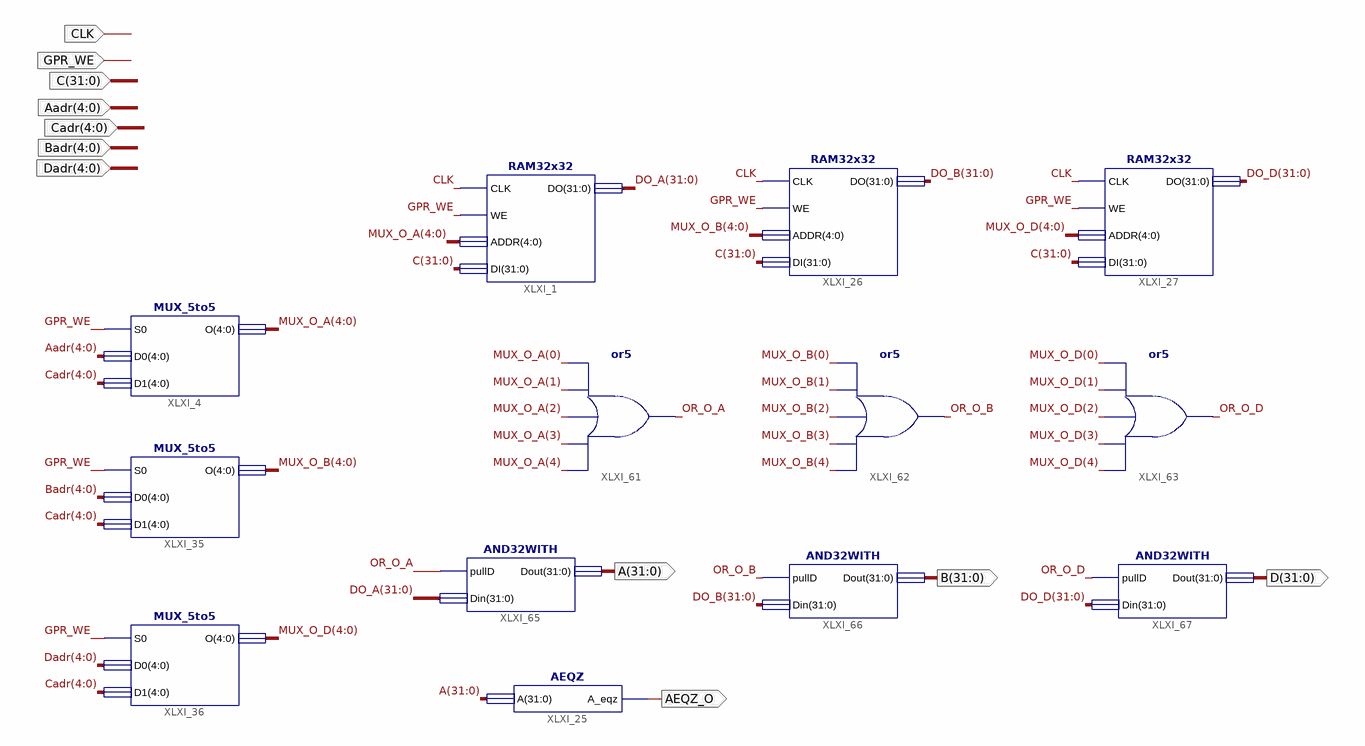
[diagram p0: schematic sheet 1]
// Xilinx ISE schematic GPR_ENVIR.sch (spartan6) as structural Verilog: 13 symbols, 11 ports
module GPR_ENVIR (
  input  CLK,
  input  GPR_WE,
  input  [31:0] C,
  input  [4:0] Cadr,
  input  [4:0] Aadr,
  input  [4:0] Badr,
  input  [4:0] Dadr,
  output [31:0] A,
  output [31:0] B,
  output [31:0] D,
  output AEQZ_O
);

  wire OR_O_A, OR_O_B, OR_O_D;
  wire [4:0] MUX_O_A, MUX_O_B, MUX_O_D;
  wire [31:0] DO_A, DO_B, DO_D;

  RAM32x32 XLXI_1 (.CLK(CLK), .WE(GPR_WE), .ADDR(MUX_O_A), .DI(C), .DO(DO_A));
  RAM32x32 XLXI_27 (.CLK(CLK), .WE(GPR_WE), .ADDR(MUX_O_D), .DI(C), .DO(DO_D));
  RAM32x32 XLXI_26 (.CLK(CLK), .WE(GPR_WE), .ADDR(MUX_O_B), .DI(C), .DO(DO_B));
  or XLXI_61 (OR_O_A, MUX_O_A[4], MUX_O_A[3], MUX_O_A[2], MUX_O_A[1], MUX_O_A[0]);
  or XLXI_62 (OR_O_B, MUX_O_B[4], MUX_O_B[3], MUX_O_B[2], MUX_O_B[1], MUX_O_B[0]);
  or XLXI_63 (OR_O_D, MUX_O_D[4], MUX_O_D[3], MUX_O_D[2], MUX_O_D[1], MUX_O_D[0]);
  AEQZ XLXI_25 (.A(A), .A_eqz(AEQZ_O));
  MUX_5to5 XLXI_4 (.S0(GPR_WE), .D0(Aadr), .D1(Cadr), .O(MUX_O_A));
  MUX_5to5 XLXI_35 (.S0(GPR_WE), .D0(Badr), .D1(Cadr), .O(MUX_O_B));
  MUX_5to5 XLXI_36 (.S0(GPR_WE), .D0(Dadr), .D1(Cadr), .O(MUX_O_D));
  AND32WITH XLXI_65 (.pullD(OR_O_A), .Din(DO_A), .Dout(A));
  AND32WITH XLXI_66 (.pullD(OR_O_B), .Din(DO_B), .Dout(B));
  AND32WITH XLXI_67 (.pullD(OR_O_D), .Din(DO_D), .Dout(D));
endmodule
